# EasyEDA Pro project ProPrj_电容计量V2_2026-06-24.epro, schematic Schematic16
Board Name: Board1; Create Date: 2026-01-06; Page Name: P1; Project Name: 电容计量1; Schematic Name: Schematic5; Update Date: 2026-01-06; Page Size: A4; Version: V1.0
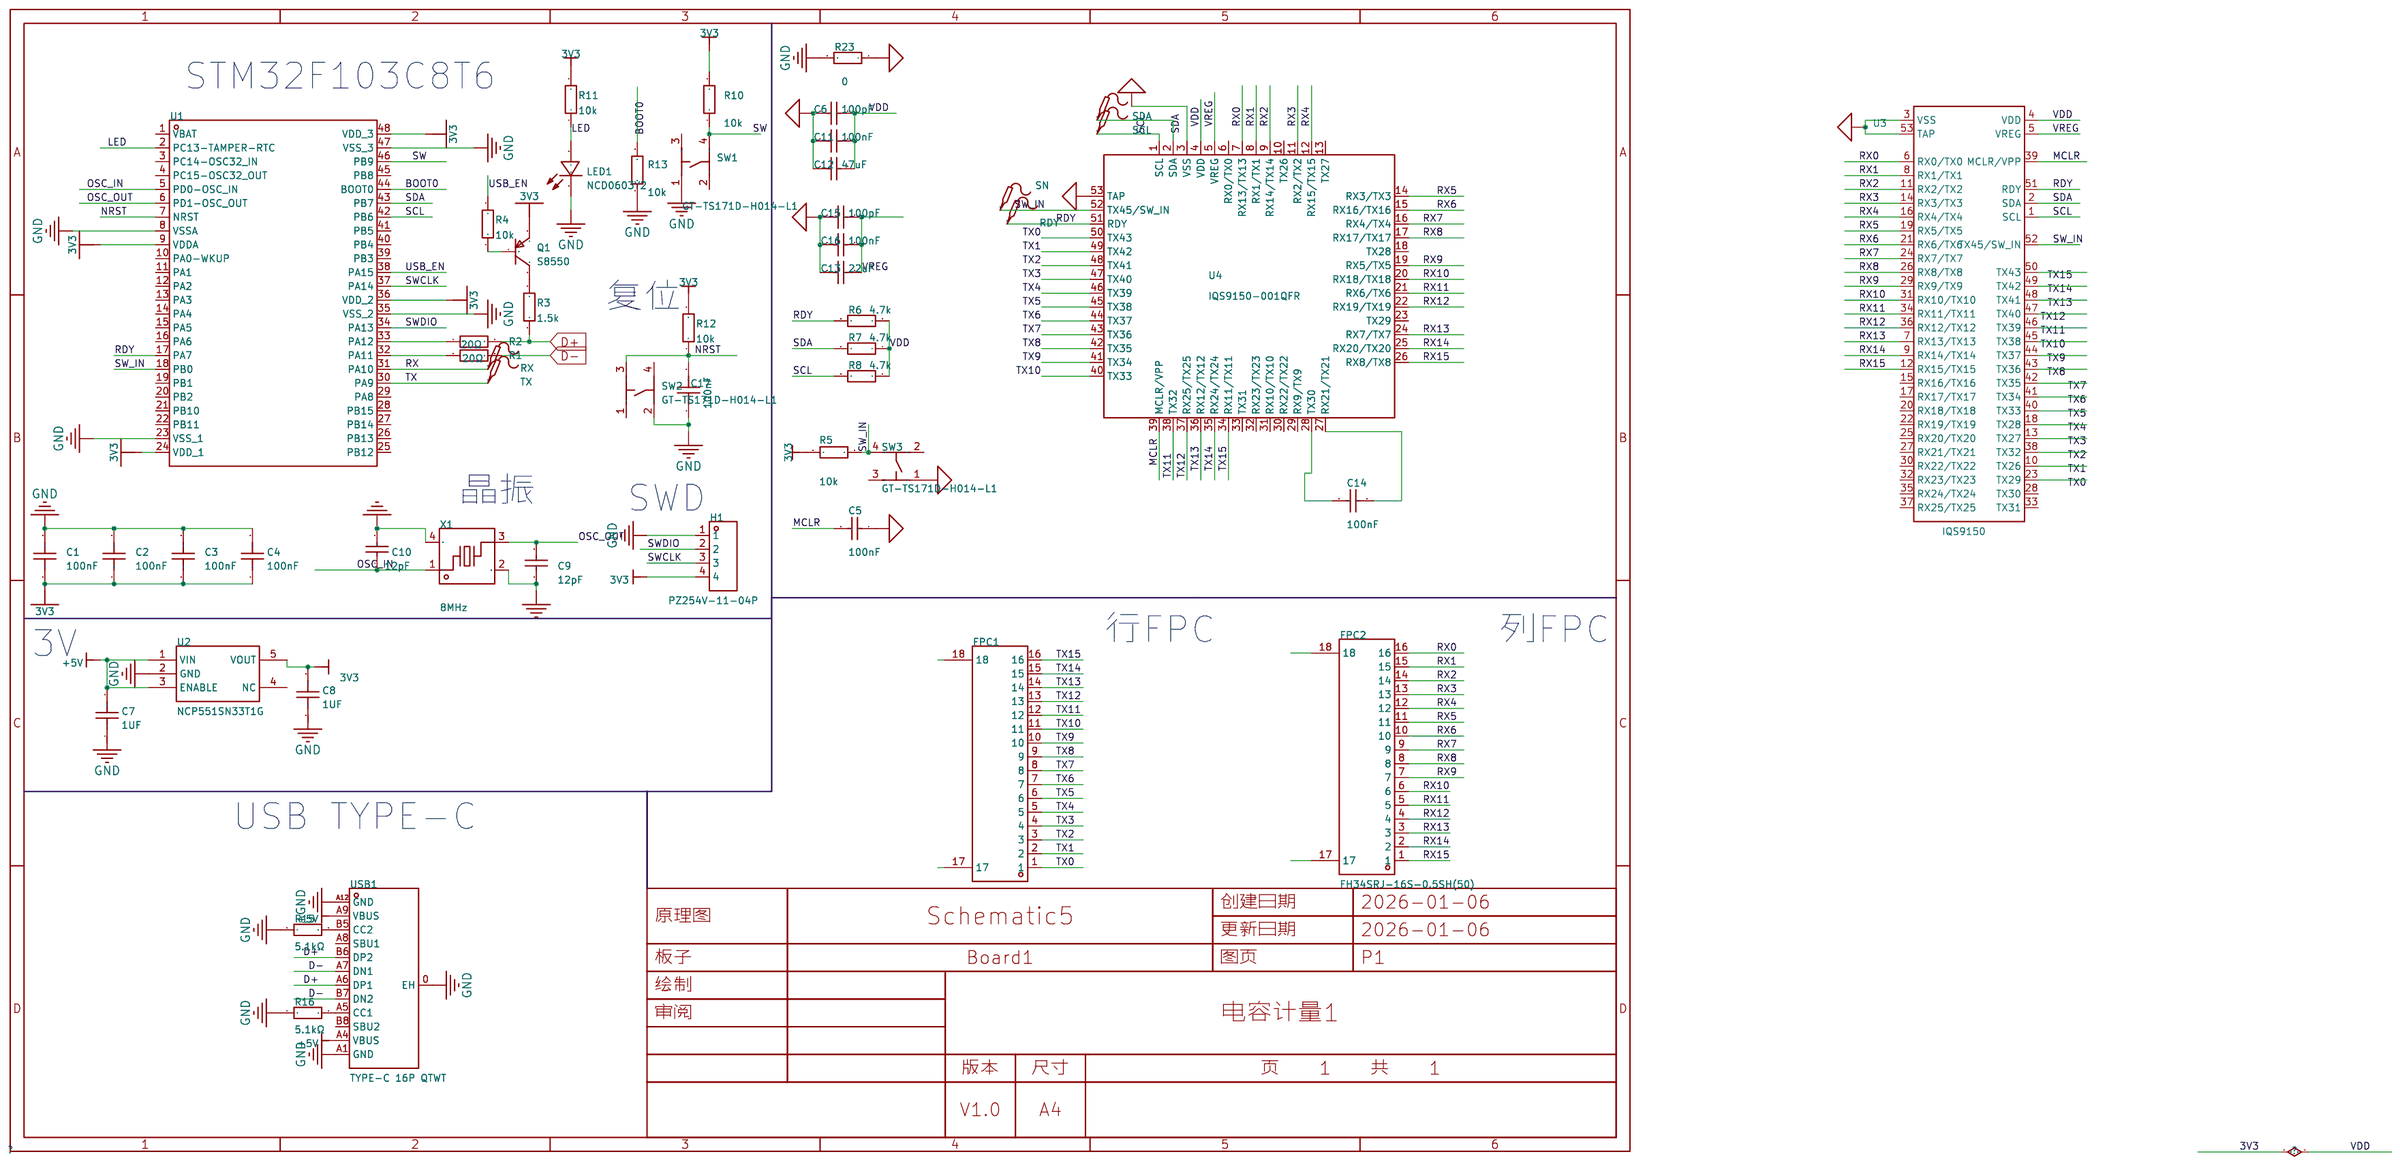
[diagram p8: schematic sheet]

## Parts
C1  100nF  [C0402]
C2  100nF  [C0402]
C3  100nF  [C0402]
C4  100nF  [C0402]
C5  100nF  [C0402]
C6  100pF  [C0402]
C7  1UF  [C0402]
C8  1UF  [C0402]
C9  12pF  [C0402]
C10  12pF  [C0402]
C11  100nF  [C0402]
C12  47uF  [C0402]
C13  22uF  [C0402]
C14  100nF  [C0402]
C15  100pF  [C0402]
C16  100nF  [C0402]
C17  100nF  [C0402]
FPC1  FH34SRJ-16S-0.5SH(50)  [FFC-SMD_16P-P0.50_FH34SRJ-16S-0.5SH]
FPC2  FH34SRJ-16S-0.5SH(50)  [FFC-SMD_16P-P0.50_FH34SRJ-16S-0.5SH]
H1  PZ254V-11-04P  [HDR-TH_4P-P2.54-V-M]
LED1  NCD0603Y2  [LED0603-RD]
Q1  S8550  [SOT-23-3_L2.9-W1.3-P1.90-LS2.4-BR]
R1  20Ω  [R0402]
R2  20Ω  [R0402]
R3  1.5k  [R0402]
R4  10k  [R0402]
R5  10k  [R0402]
R6  4.7k  [R0402]
R7  4.7k  [R0402]
R8  4.7k  [R0402]
R10  10k  [R0402]
R11  10k  [R0402]
R12  10k  [R0402]
R13  10k  [R0402]
R15  5.1kΩ  [R0402]
R16  5.1kΩ  [R0402]
R23  0  [R0402]
RDY  -  [Test-Point-0.5mm]
RX  -  [Test-Point-0.5mm]
SCL  -  [Test-Point-0.5mm]
SDA  -  [Test-Point-0.5mm]
SN  -  [Test-Point-0.5mm]
SW1  GT-TS171D-H014-L1  [SW-SMD_4P-L3.0-W2.8-P1.65-TL_GT-TS171A-H014-L1]
SW2  GT-TS171D-H014-L1  [SW-SMD_4P-L3.0-W2.8-P1.65-TL_GT-TS171A-H014-L1]
SW3  GT-TS171D-H014-L1  [SW-SMD_4P-L3.0-W2.8-P1.65-TL_GT-TS171A-H014-L1]
TX  -  [Test-Point-0.5mm]
U1  -  [LQFP-48_L7.0-W7.0-P0.50-LS9.0-BL]
U2  NCP551SN33T1G  [SOT-23-5_L3.0-W1.7-P0.95-LS2.8-BR]
U3  IQS9150  [QFN1-52_L6.0-W6.0-P0.40-TL-EP4.5]
U4  IQS9150-001QFR  [QFN1-52_L6.0-W6.0-P0.40-TL-EP4.5]
USB1  TYPE-C 16P QTWT  [USB-TYPE-C-SMD_TYPE-C-16P-QTWT]
X1  8MHz  [CRYSTAL-SMD_4P-L3.2-W2.5-BL-1]

## Library data of the parts
C1-C4 C7 C8 = CC0402KRX7R7BB104: 容值:100nF;精度:±10%;额定电压:16V;温度系数:X7R;; LCSC Part Name: 100nF ±10% 16V; Supplier Part: C60474; Manufacturer: YAGEO(国巨); Supplier Footprint: 0402; JLCPCB Part Class: Extended Part; Datasheet: https://atta.szlcsc.com/upload/public/pdf/source/20211223/9278FD768280B81DDBEF48FA36411A03.pdf; Supplier: LCSC; Tolerance: ±10%; Voltage Rated: 16V; Temperature Coefficient: X7R
C5 C6 C9-C16 = GCM1555C1H120FA16D: 容值:12pF;精度:±1%;额定电压:50V;材质(温度系数):C0G;; LCSC Part Name: 12pF ±1% 50V; Supplier Part: C393682; Manufacturer: muRata(村田); Supplier Footprint: 0402; JLCPCB Part Class: Extended Part; Datasheet: https://atta.szlcsc.com/upload/public/pdf/source/20190516/C393682_2405B7553F1D74F0F214F12B2CF6E34B.pdf; Supplier: LCSC; Tolerance: ±1%; Voltage Rated: 50V; Temperature Coefficient: C0G
C17 = CC0603KRX7R9BB104: 容值:100nF;精度:±10%;额定电压:50V;材质(温度系数):X7R;; LCSC Part Name: 100nF ±10% 50V; Supplier Part: C14663; Manufacturer: YAGEO(国巨); Supplier Footprint: 0603; JLCPCB Part Class: Basic Part; Datasheet: https://atta.szlcsc.com/upload/public/pdf/source/20170116/1484561234239.pdf; Supplier: LCSC; Tolerance: ±10%; Voltage Rated: 50V; Temperature Coefficient: X7R
FPC1 FPC2 = FH34SRJ-16S-0.5SH(50): 锁定特性:-;触点类型:双侧触点/上下接;触点数量:16P;间距:0.5mm;安装方式:卧贴;工作温度:-55℃~+105℃;; LCSC Part Name: 间距:0.5mm P数:16P 双侧触点/上下接; Supplier Part: C324725; Manufacturer: HRS(广濑); Supplier Footprint: SMD,P=0.5mm,卧贴; JLCPCB Part Class: 扩展库; Datasheet: https://item.szlcsc.com/datasheet/FH34SRJ-16S-0.5SH(50)/305535.html; Supplier: LCSC; Contact Type: 双侧触点/上下接; Number of Contacts: 16P; Pitch: 0.5mm; Mounting Type: 卧贴; FFC, FCB Thickness: 0.3mm; Height Above Board: 1mm; Contact Material: 磷青铜; Contact Plating: 金; Operating Temperature: -55℃~+105℃
H1 = PZ254V-11-04P: 插针结构:1x4P;间距:2.54mm;行距:-;圆针/方针:方针;安装方式:直插;排数:单排;总PIN位数:4P;额定电流:3A;额定电压:250V;配合针长度:6mm;塑高:2.5mm;端接针长度:3mm;触头材质:-;工作温度:-40℃~+105℃;颜色:黑色;; LCSC Part Name: 1x4P 间距:2.54mm 方针 直插; Supplier Part: C2691448; Manufacturer: XFCN(兴飞); Supplier Footprint: 插件,P=2.54mm; JLCPCB Part Class: 扩展库; Datasheet: https://item.szlcsc.com/datasheet/PZ254V-11-04P/2801085.html; Supplier: LCSC; Pin Structure: 1x4P; Pitch: 2.54mm; Circluar Pins/Square Pins: 方针; Mounting Type: 直插; Number of Rows: 单排; Number of Pins: 4P; Current Rating: 3A; Voltage Rating (Max): 250V; Length of Mating Pin: 6mm; Insulation Height: 2.5mm; Length of End Connection Pin: 3mm; Operating Temperature: -40℃~+105℃; Color: 黑色
LED1 = NCD0603Y2: 发光颜色:黄色;正向电压(VF):1.6V~2.6V;功率:65mW;正向电流:20mA;主波长:586nm~595nm;透镜颜色:无色透明透镜;发光强度:100mcd~220mcd;发光角度:130°;工作温度:-30℃~+85℃;; Supplier Part: C89811; Manufacturer: 国星光电; Supplier Footprint: 0603; JLCPCB Part Class: Extended Part; Datasheet: https://atta.szlcsc.com/upload/public/pdf/source/20200820/C89811_7FE84B429B6BCA3E113B125EE1452576.pdf; Supplier: LCSC; Emitted Color: 黄色; Forward Voltage (VF): 1.6V~2.6V; Power Dissipation: 65mW; Forward Current: 20mA; Dominant Wavelength: 586nm~595nm; Lens Color: 无色透明透镜; Luminous Intensity: 100mcd~220mcd; Viewing Angle: 130°; Operating Temperature: -30℃~+85℃
Q1 = S8550: LCSC Part Name: PNP -25V -500mA 120-400 SOT-23; Supplier Part: C2931720; Manufacturer: Doeshare(德芯); Supplier Footprint: SOT-23; JLCPCB Part Class: 扩展库; Datasheet: https://atta.szlcsc.com/upload/public/pdf/source/20220104/15A23F6542E365B9E2BA018BE45092B6.pdf; Supplier: LCSC
R1 R2 = 0402WGJ0102TCE: 电阻类型:厚膜电阻;阻值:1kΩ;精度:±5%;功率:1/16W;温度系数:±100ppm/℃;最大工作电压:50V;工作温度范围:-55℃~+155℃;; LCSC Part Name: 1kΩ ±5%; Supplier Part: C25543; Manufacturer: UNI-ROYAL(厚声); Supplier Footprint: 0402; JLCPCB Part Class: Extended Part; Datasheet: https://atta.szlcsc.com/upload/public/pdf/source/20200306/C422600_1E6D84923E4A46A82E41ADD87F860B5C.pdf; Supplier: LCSC; Type: 厚膜电阻; Tolerance: ±5%; Power(Watts): 1/16W; Temperature Coefficient: ±100ppm/℃; Overload Voltage (Max): 50V; Operating Temperature Range: -55℃~+155℃
R3-R8 R10-R13 R23 = 0603WAF1002T5E: LCSC Part Name: 10KΩ(1002) ±1% 编带; Supplier Part: C25804; Manufacturer: UNI-ROYAL(厚声); Supplier Footprint: 0603; JLCPCB Part Class: Basic Part; Datasheet: https://atta.szlcsc.com/upload/public/pdf/source/20170920/C25804_1505901551523983377.pdf; Supplier: LCSC
R15 R16 = 0805W8F5101T5E: 精度:±1%;温度系数:±100ppm/;阻值:5.1kΩ;功率:1/8W;最大工作电压:150V;工作温度范围:-55~+155;; LCSC Part Name: 5.1kΩ ±1%; Supplier Part: C27834; Manufacturer: UNI-ROYAL(厚声); Supplier Footprint: 0805; JLCPCB Part Class: 基础库; Datasheet: https://atta.szlcsc.com/upload/public/pdf/source/20170920/C27834_1505895234018981184.pdf; Supplier: LCSC; Tolerance: ±1%; Temperature Coefficient: ±100ppm/; Power(Watts): 1/8W; Overload Voltage (Max): 150V; Operating Temperature Range: -55~+155
RDY RX SCL SDA SN TX = Test-Point: Test Point 测试点
SW1-SW3 = GT-TS171D-H014-L1: 电路结构:单刀单掷;按钮形状:圆形按钮;作用力:80gf;安装方式:立贴;开关长度:3mm;开关宽度:2.75mm;开关高度:1.4mm;带支架:不带支架;触点电流:50mA;额定电压:12V;带灯:无;工作寿命:10万次;; LCSC Part Name: 3*2.75*1.4mm 立贴 轻触开关; Supplier Part: C2762969; Manufacturer: G-Switch(品赞); Supplier Footprint: SMD; JLCPCB Part Class: Extended Part; Datasheet: https://item.szlcsc.com/datasheet/GT-TS171D-H014-L1/2892001.html; Supplier: LCSC; Circuit: 单刀单掷; Actuator Style: 圆形按钮; Operating Force: 80gf; Mounting Type: 立贴; Length: 3mm; Width: 2.75mm; Switch Height: 1.4mm; with Bracket: 不带支架; Contact Current: 50mA; Voltage Rating: 12V; Actuator/Cap Color: 白色; With Lamp: 无; Termination Style: SMD接片; Life: 10万次; Operating Temperature: -30℃~+85℃
U1 = STM32F103C8T6: 工作电压:2V ~ 3.6V;CPU位数:32-Bit;CPU内核:ARM- Cortex--M3;主频（MAX):72MHz;ROM类型:FLASH;; Supplier Part: C8734; Manufacturer: ST(意法半导体); Supplier Footprint: LQFP-48_7x7x05P; JLCPCB Part Class: Basic Part; Datasheet: https://atta.szlcsc.com/upload/public/pdf/source/20140724/1457707174202.pdf; Supplier: LCSC
U2 = NCP551SN33T1G: 输出类型:固定;最大输入电压:12V;输出电压:3.3V;最大输出电流:150mA;电源纹波抑制比(PSRR):-;输出极性:正极;; LCSC Part Name: 输入12V 输出3.3V 150mA; Supplier Part: C58434; Manufacturer: onsemi(安森美); Supplier Footprint: TSOP-5; JLCPCB Part Class: 扩展库; Datasheet: https://atta.szlcsc.com/upload/public/pdf/source/20150917/1457707389016.pdf; Supplier: LCSC; Output Type: 固定; Maximum Input Voltage: 12V; Output Voltage: 3.3V; MAX Output Current: 150mA; Dropout Voltage: 150mV@(10mA); standby current: 8uA; Operating Temperature: -40℃~+85℃; Output Polarity: 正极; Number of Outputs: 1
U3 U4 = IQS9150-001QFR: Supplier Part: C42000478; JLCPCB Part Class: Extended Part; Supplier: LCSC
USB1 = TYPE-C 16P QTWT: 连接器类型:Type-C;协议标准:USB 3.1;公母:母;安装方式:卧贴;触点数量:16P;端口数量:1;额定电流 - 电源:3A;工作温度:-25℃~+85℃;; LCSC Part Name: Type-C 母 卧贴; Supplier Part: C5187472; Manufacturer: SHOU HAN(首韩); Supplier Footprint: SMD; JLCPCB Part Class: Extended Part; Datasheet: https://item.szlcsc.com/datasheet/TYPE-C%252016P%2520QTWT/5860367.html; Supplier: LCSC; Connector Type: Type-C; Protocol Standard: USB 3.1; Gender: 母; Mounting Type: 卧贴; Number of Contacts: 16P; Number of Ports: 1; Current Rating-Power: 3A; Voltage Rating: 5V; Connect-Disconnect Life: 5千次; Detection color: 黑色; Operating Temperature: -25℃~+85℃
X1 = XL2EL89COI-111YLC-8M: 晶振类型:贴片晶振;频率:8MHz;常温频差:±10ppm;外接负载电容:12pF;频率稳定度(全温):±20ppm;; LCSC Part Name: 8MHz ±10ppm 12pF; Supplier Part: C2973805; Manufacturer: YXC(扬兴晶振); Supplier Footprint: SMD3225-4P; JLCPCB Part Class: 扩展库; Datasheet: https://atta.szlcsc.com/upload/public/pdf/source/20240329/19D5F850207469550BEB00D7DFEDBC7A.pdf; Supplier: LCSC; Crystal Type: 贴片晶振; Normal temperature Frequency Tolerance: ±10ppm; External load capacitor: 12pF; Frequency Stability(Full temperature range): ±20ppm; Equivalent Series Resistance (ESR): 150Ω; Operating Temperature: -40℃~+85℃

## Nets
3V3: C1.1 C2.1 C3.1 C4.1 C6.1 C8.2 C11.1 C12.1 H1.4 Q1.2(E) R5.2 R6.1 R7.1 R8.1 R10.2 R11.2 R12.2 U1.9(VDDA) U1.24(VDD_1) U1.36(VDD_2) U1.48(VDD_3) U2.5(VOUT) U3.4(VDD) U4.4(VDD)
+5V: C7.2 U2.1(VIN) U2.3(ENABLE) USB1.A4(VBUS) USB1.A9(VBUS)
AGND: C5.1 C6.2 C11.2 C12.2 C13.2 C15.2 C16.2 R23.1 SW3.1 U3.3(VSS) U3.53(TAP) U4.3(VSS) U4.53(TAP)
GND: C1.2 C2.2 C3.2 C4.2 C7.1 C8.1 C9.1 C10.2 C17.1 H1.1 LED1.1(K) R13.1 R15.2 R16.2 R23.2 SW1.1 SW2.2 U1.8(VSSA) U1.23(VSS_1) U1.35(VSS_2) U1.47(VSS_3) U2.2(GND) USB1.0(EH) USB1.A1(GND) USB1.A12(GND) X1.2(GND) X1.4(GND)
BOOT0: R13.2 U1.44(BOOT0)
D+: R2.2 R3.1 USB1.A6(DP1) USB1.B6(DP2)
D-: R1.2 USB1.A7(DN1) USB1.B7(DN2)
LED: LED1.2(A) R11.1 U1.2(PC13-TAMPER-RTC)
MCLR: C5.2 U3.39(MCLR/VPP) U4.39(MCLR/VPP)
NRST: C17.2 R12.1 SW2.3 U1.7(NRST)
OSC_IN: C10.1 U1.5(PD0-OSC_IN) X1.1
OSC_OUT: C9.2 U1.6(PD1-OSC_OUT) X1.3
RDY: R6.2 RDY.1 U1.17(PA7) U3.51(RDY) U4.51(RDY)
RX: RX.1 U1.31(PA10)
RX0: FPC2.16 U3.6(RX0/TX0) U4.7(RX13/TX13)
RX1: FPC2.15 U3.8(RX1/TX1) U4.8(RX1/TX1)
RX2: FPC2.14 U3.11(RX2/TX2) U4.9(RX14/TX14)
RX3: FPC2.13 U3.14(RX3/TX3) U4.11(RX2/TX2)
RX4: FPC2.12 U3.16(RX4/TX4) U4.12(RX15/TX15)
RX5: FPC2.11 U3.19(RX5/TX5) U4.14(RX3/TX3)
RX6: FPC2.10 U3.21(RX6/TX6) U4.15(RX16/TX16)
RX7: FPC2.9 U3.24(RX7/TX7) U4.16(RX4/TX4)
RX8: FPC2.8 U3.26(RX8/TX8) U4.17(RX17/TX17)
RX9: FPC2.7 U3.29(RX9/TX9) U4.19(RX5/TX5)
RX10: FPC2.6 U3.31(RX10/TX10) U4.20(RX18/TX18)
RX11: FPC2.5 U3.34(RX11/TX11) U4.21(RX6/TX6)
RX12: FPC2.4 U3.36(RX12/TX12) U4.22(RX19/TX19)
RX13: FPC2.3 U3.7(RX13/TX13) U4.24(RX7/TX7)
RX14: FPC2.2 U3.9(RX14/TX14) U4.25(RX20/TX20)
RX15: FPC2.1 U3.12(RX15/TX15) U4.26(RX8/TX8)
SCL: R8.2 SCL.1 U1.42(PB6) U3.1(SCL) U4.1(SCL)
SDA: R7.2 SDA.1 U1.43(PB7) U3.2(SDA) U4.2(SDA)
SW: R10.1 SW1.4 U1.46(PB9)
SW_IN: R5.1 SN.1 SW3.4 U1.18(PB0) U3.52(TX45/SW_IN) U4.52(TX45/SW_IN)
SWCLK: H1.3 U1.37(PA14)
SWDIO: H1.2 U1.34(PA13)
TX: TX.1 U1.30(PA9)
TX0: FPC1.1 U3.23(TX29) U4.50(TX43)
TX1: FPC1.2 U3.10(TX26) U4.49(TX42)
TX2: FPC1.3 U3.38(TX32) U4.48(TX41)
TX3: FPC1.4 U3.13(TX27) U4.47(TX40)
TX4: FPC1.5 U3.18(TX28) U4.46(TX39)
TX5: FPC1.6 U3.40(TX33) U4.45(TX38)
TX6: FPC1.7 U3.41(TX34) U4.44(TX37)
TX7: FPC1.8 U3.42(TX35) U4.43(TX36)
TX8: FPC1.9 U3.43(TX36) U4.42(TX35)
TX9: FPC1.10 U3.44(TX37) U4.41(TX34)
TX10: FPC1.11 U3.45(TX38) U4.40(TX33)
TX11: FPC1.12 U3.46(TX39) U4.38(TX32)
TX12: FPC1.13 U3.47(TX40) U4.37(RX25/TX25)
TX13: FPC1.14 U3.48(TX41) U4.36(RX12/TX12)
TX14: FPC1.15 U3.49(TX42) U4.35(RX24/TX24)
TX15: FPC1.16 U3.50(TX43) U4.34(RX11/TX11)
USB_EN: R4.2 U1.38(PA15)
VREG: C13.1 C15.1 C16.1 U3.5(VREG) U4.5(VREG)
$1N12: R16.1 USB1.A5(CC1)
$1N14: R15.1 USB1.B5(CC2)
$1N194: Q1.1(B) R4.1
$1N196: Q1.3(C) R3.2
$1N212: R2.1 U1.33(PA12)
$1N232: R1.1 U1.32(PA11)
$1N481: C14.2 U4.28(TX30)
$1N482: C14.1 U4.27(RX21/TX21)

Not connected (* = marked no-connect by the designer): FPC1 17 18; FPC2 17 18; SW1 2 3; SW2 1 4; SW3 2 3; U1 1(VBAT) 3(PC14-OSC32_IN) 4(PC15-OSC32_OUT) 10(PA0-WKUP) 11(PA1) 12(PA2) 13(PA3) 14(PA4) 15(PA5) 16(PA6) 19(PB1) 20(PB2) 21(PB10) 22(PB11) 25(PB12) 26(PB13) 27(PB14) 28(PB15) 29(PA8) 39(PB3) 40(PB4) 41(PB5) 45(PB8); U2 4(NC); U3 15(RX16/TX16) 17(RX17/TX17) 20(RX18/TX18) 22(RX19/TX19) 25(RX20/TX20) 27(RX21/TX21) 28(TX30) 30(RX22/TX22) 32(RX23/TX23) 33(TX31) 35(RX24/TX24) 37(RX25/TX25); U4 6(RX0/TX0) 10(TX26) 13(TX27) 18(TX28) 23(TX29) 29(RX9/TX9) 30(RX22/TX22) 31(RX10/TX10) 32(RX23/TX23) 33(TX31); USB1 A8(SBU1) B8(SBU2)

## Notes on the sheet
- STM32F103C8T6
- 复位
- 晶振
- SWD
- 行FPC
- 列FPC
- 3V
- USB TYPE-C
